# EasyEDA Pro project ProPrj_ftdi-jtag-xilinx_2025-01-01.epro, board PCB1
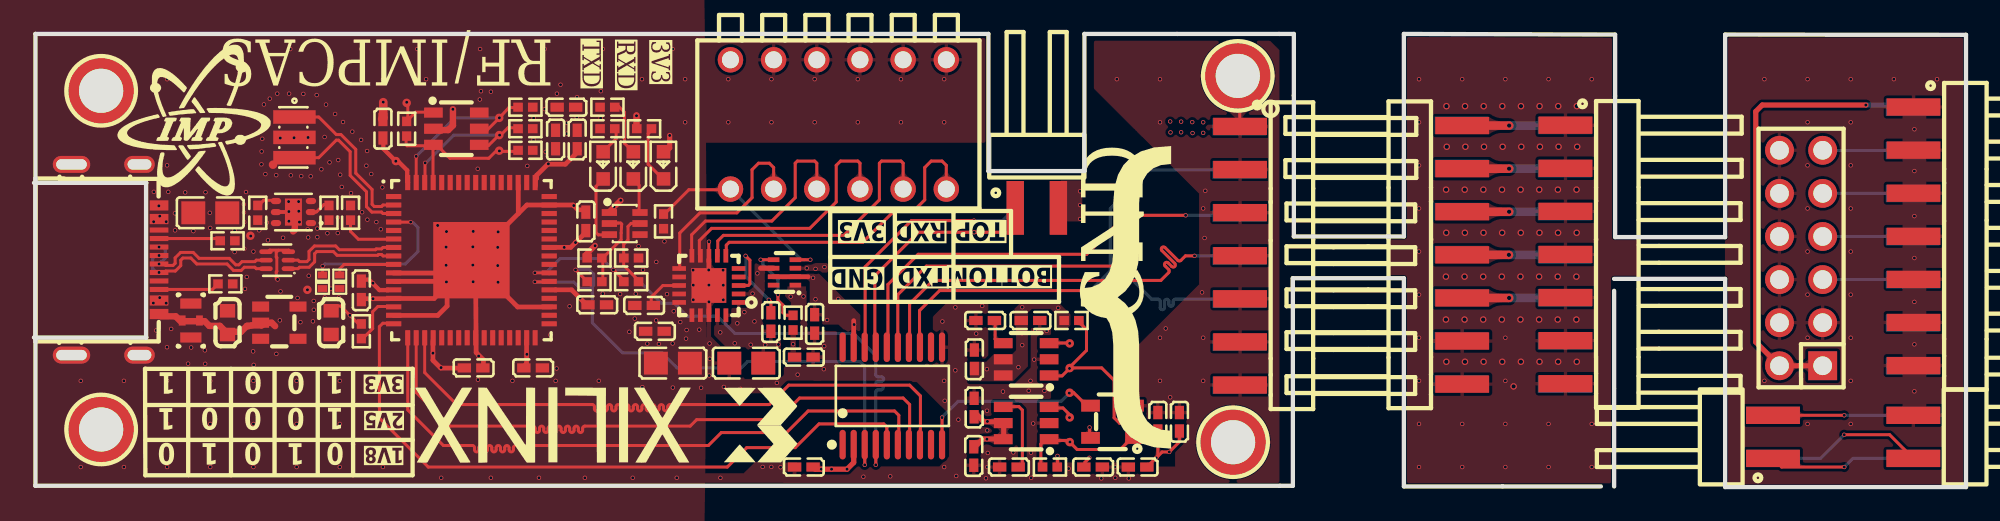
[diagram p3: board, top side]
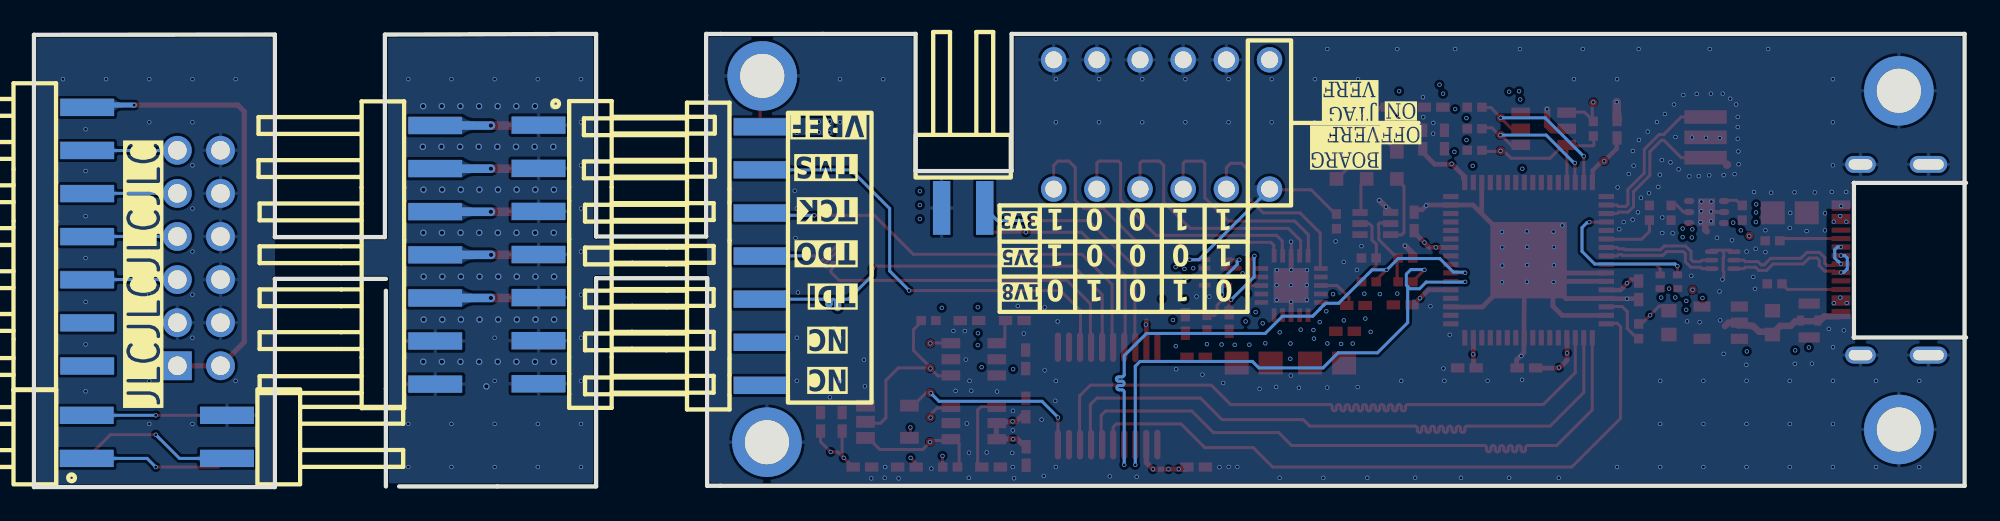
[diagram p4: board, bottom side, seen from below]

Outline 113.67 x 26.71 mm; copper layers: Top Layer, Inner1, Inner2, Bottom Layer. Coordinates in mm from the lower left corner of the outline.
Outline path: 74.07,12.31 80.6,12.31 80.6,0.04 92.19,0.04 ; 74.07,12.31 74.07,11.61 ; 74.07,12.31 74.07,0.08 0.08,0.08 0.08,26.71 56.15,26.71 56.15,18.62 61.8,18.62 61.8,26.71 74.12,26.71 74.12,14.77 80.6,14.77 80.6,19.34 80.6,19.34 80.6,26.71 93.03,26.67 93.03,14.73 99.5,14.73 99.5,19.3 99.5,19.3 99.5,26.67 113.67,26.66 113.67,0 99.5,0 99.5,12.27 92.97,12.27 ; 92.97,11.57 92.97,0.04
Stack: Top Layer 0.035mm 外层铜厚1oz / Dielectric1 0.2104mm 7628 RC49% 8.6mil / Inner1 0.0152mm 内层铜厚 / Dielectric2 1.065mm 1.1mm H/HOZ Copper / Inner2 0.0152mm 内层铜厚 / Dielectric3 0.2104mm 7628 RC49% 8.6mil / Bottom Layer 0.035mm 外层铜厚1oz

## Design rules (mm)
net USB_DP_O: USB2
net USB_DN_O: USB2
net USB_DN: USB1
net USB_DP: USB1
net OSCO: OSC
net OSCI: OSC
template: 自定义配置
spacing copperThickness1oz (default): track to track 0.102, other pairs 0.152 to 0.3
spacing copperThickness2oz: track to track 0.203, other pairs 0.152 to 0.3
track width copperThickness1oz (default): min 0.127, default 0.178, max 2.54
track width copperThickness2oz: min 0.203, default 0.254, max 2.54
differential pair differentialPair (default): width min 0.127, default 0.254, max 2.54; gap min 0.152, default 0.152
via viaSize (default): diameter min 0.254, default 0.254, max 10; hole min 0.178, default 0.178, max 6.3

## Placement (name value [footprint] x y rotation side)
C1  100nF  [C0402]  25.87 7.02 180 top
C2  100nF  [C0402]  29.37 7.02 180 top
C3  100nF  [C0402]  32.47 15.66 270 top
C4  100nF  [C0402]  30.69 20.48 270 top
C5  100nF  [C0402]  55.31 4.69 270 top
C6  100nF  [C0402]  55.29 1.83 90 top
C7  100nF  [C0402]  62.31 1.18 180 top
C8  100nF  [C0402]  67.39 3.85 270 top
C9  100nF  [C0402]  31.96 20.48 270 top
C10  100nF  [C0402]  33.14 10.74 180 top
C11  100nF  [C0402]  20.53 21.12 270 top
C12  10uF  [C0603]  11.39 9.69 270 top
C13  4.7uF  [C0402]  19.26 11.59 270 top
C14  100nF  [C0402]  31.33 22.39 180 top
C15  NFM21PC104R1E3D  [CAP-SMD_4P-L2.0-W1.25]  9.23 9.82 270 top
C16  10uF  [C0603]  17.48 9.69 90 top
C17  22uF  [C0805]  10.37 16.17 0 top
C18  100nF  [C0402]  66.12 3.85 270 top
C19  100nF  [C0402]  55.33 7.53 270 top
C20  100nF  [C0402]  45.3 1.18 0 top
C21  100pF  [C0402]  57.36 1.18 0 top
C22  100pF  [C0402]  55.96 9.82 0 top
C23  22uF  [C0805]  37.59 7.31 180 top
C24  100nF  [C0402]  36.53 9.18 180 top
C25  22uF  [C0805]  41.91 7.31 180 top
C26  100nF  [C0402]  64.93 1.18 0 top
C27  100nF  [C0402]  45.3 7.66 180 top
C28  100nF  [C0402]  58.63 9.82 180 top
C29  100nF  [C0402]  45.93 9.62 90 top
C30  10nF  [C0402]  35.9 10.71 180 top
C31  10nF  [C0402]  43.35 9.73 90 top
H1  PZ2.54-2x6-11.2  [HDR-TH_12P-P2.54-V-M-R2-C6-S2.54]  103.97 13.5 90 top
L1  ECMF02-2AMX6  [UFQFN-6_L1.7-W1.5]  14.31 13.37 180 top
L2  BLM15PD121SN1D  [L0402]  17.99 12.1 270 top
L3  BLM15PD121SN1D  [L0402]  16.98 12.1 90 top
LED1  NCD0603Y1  [LED0603-RD]  37.04 18.96 90 top
LED2  NCD0603Y1  [LED0603-RD]  35.26 18.96 90 top
LED3  NCD0603Y1  [LED0603-RD]  33.49 18.96 90 top
Q1  BSS138PS,115  [SOT-363_L2.0-W1.3-P0.65-LS2.1-BR]  34.76 15.53 180 top
R1  5.1kΩ  [R0402]  11.26 11.98 180 top
R2  5.1kΩ  [R0402]  11.39 14.52 180 top
R3  10kΩ  [R0402]  35.9 21.12 0 top
R4  10kΩ  [R0402]  33.74 22.39 180 top
R5  100kΩ  [R0402]  32.98 13.5 0 top
R6  56kΩ  [R0402]  17.36 16.17 270 top
R7  100Ω  [R0402]  32.98 12.1 180 top
R8  100kΩ  [R0402]  35.14 13.5 0 top
R9  100Ω  [R0402]  35.14 12.1 0 top
R10  10kΩ  [R0402]  28.91 22.39 180 top
R11  10kΩ  [R0402]  28.91 21.12 180 top
R12  200kΩ  [R0402]  13.17 16.17 270 top
R13  10kΩ  [R0402]  33.74 21.12 0 top
R14  12kΩ  [R0402]  18.63 16.17 270 top
R15  1kΩ  [R0402]  19.26 9.18 270 top
R16  10kΩ  [R0402]  59.77 1.18 180 top
R17  10kΩ  [R0402]  61.04 9.82 0 top
R18  2kΩ  [R0402]  21.93 21.12 270 top
R19  10kΩ  [R0402]  28.91 19.85 0 top
R20  10kΩ  [R0402]  44.66 9.69 90 top
R21  10kΩ  [R0402]  37.04 15.66 90 top
SW1  SMQP-06B-TP  [SW-TH_12P-P2.54_SMQP-06B-TP]  47.33 21.37 180 top
TP1  -  [Test-Point-0.5mm]  21.29 19.22 0 top
TP2  -  [Test-Point-0.5mm]  12.73 14.81 270 top
TP3  -  [Test-Point-0.5mm]  16.09 11.63 0 top
TP4  -  [Test-Point-0.5mm]  27.37 21.76 0 top
TP5  -  [Test-Point-0.5mm]  27.37 20.75 0 top
TP6  -  [Test-Point-0.5mm]  21.93 22.64 0 top
TP7  -  [Test-Point-0.5mm]  60.94 2.65 0 top
TP8  -  [Test-Point-0.5mm]  60.94 7.01 0 top
TP9  -  [Test-Point-0.5mm]  27.37 19.83 0 top
TP10  -  [Test-Point-0.5mm]  60.94 4.11 0 top
TP11  -  [Test-Point-0.5mm]  60.94 8.47 0 top
TP12  -  [Test-Point-0.5mm]  60.94 5.56 0 top
TP13  -  [Test-Point-0.5mm]  14.06 19 0 top
U1  -  [JTAG_V3]  71.08 13.63 0 top
U2  FT2232HQ-REEL  [QFN-64_L9.0-W9.0-P0.50-TL-EP4.3]  25.74 13.37 0 top
U3  -  [2x2p侧贴排针]  59 16.45 90 top
U4  TPS25200DRVR  [WSON-6_L2.0-W2.0-P0.65-TL-EP]  15.27 16.21 180 top
U5  TPS7A2033PDBVR  [SOT-23-5_L2.9-W1.6-P0.95-LS2.8-BR]  14.44 9.69 180 top
U6  93LC56BT-I/OT  [SOT-23-6_L2.9-W1.6-P0.95-LS2.8-BR]  24.85 21.12 180 top
U7  TPS3808G33DBVR  [SOT-23-6_L2.9-W1.6-P0.95-LS2.8-BR]  58.38 7.53 0 top
U8  SN74LVC1G08DBVR  [TSOT-23-5_L2.9-W1.6-P0.95-LS2.8-BR]  63.46 3.85 0 top
U9  TPS3808G33DBVR  [SOT-23-6_L2.9-W1.6-P0.95-LS2.8-BR]  58.38 3.77 0 top
U10  TXB0108PWR  [TSSOP-20_L6.5-W4.4-P0.65-LS6.4-BL]  50.5 5.37 0 top
U11  TPS7A8300RGRR  [VQFN-20_L3.5-W3.5-P0.50-BL-EP2.0]  39.71 11.88 90 top
U12  -  [M2焊接螺柱]  3.95 23.36 0 top
U13  -  [M2焊接螺柱]  70.55 2.64 90 top
U14  -  [M2焊接螺柱]  3.95 3.4 0 top
U15  -  [M2焊接螺柱]  70.83 24.23 90 top
U16  TPS2116DRLR  [SOT-583-8_L2.1-W1.6-P0.50-LS1.6-BL]  44.16 12.65 90 top
U17  -  [JTAG_V3]  110.7 14.77 0 top
U18  -  [JTAG_V3]  83.87 13.7 180 bottom
U19  -  [JTAG_V3]  90.22 13.7 0 top
U20  -  [2x2p侧贴排针]  110.57 2.96 0 bottom
U21  -  [2x2p侧贴排针]  102.32 2.96 180 top
USB1  TYPEC-302-BRP16SC16  [USB-C-SMD_TYPEC-302-BRP16SC16]  4.78 13.4 270 top
X1  12MHz  [CRYSTAL-SMD_3P-L3.2-W1.3-P1.2-BL]  15.32 20.61 270 top

## Footprints (pads in the part's own frame, mm; a bottom-side part is the same pattern mirrored in y, then rotated)
2x2p侧贴排针
  rect 3.17x1.02 smd: 1(0,1.27) 3(0,-1.27)
  rect 3.17x1.02 smd far side: 2(0,1.27) 4(0,-1.27)
C0402
  rect 0.79x0.54 smd: 1(-0.545,0) 2(0.545,0)
C0603
  rect 0.8x0.9 smd: 1(-0.7,0) 2(0.7,0)
C0805
  rect 1.41x1.35 smd: 1(-1,0) 2(1,0)
CAP-SMD_4P-L2.0-W1.25
  rect 0.6x1.25 smd: 1(-1,0) 3(1,0)
  rect 0.6x0.4 smd: 2(0,-0.508) 4(0,0.508)
CRYSTAL-SMD_3P-L3.2-W1.3-P1.2-BL
  rect 0.8x2.5 smd: 1(-1.2,0) 2(0,0) 3(1.2,0)
HDR-TH_12P-P2.54-V-M-R2-C6-S2.54
  rect 1.7x1.7 hole 1.1: 1(-6.35,-1.27)
  round 1.7 hole 1.1: 2(-6.35,1.27) 3(-3.81,-1.27) 4(-3.81,1.27) 5(-1.27,-1.27) 6(-1.27,1.27) 7(1.27,-1.27) 8(1.27,1.27) 9(3.81,-1.27) 10(3.81,1.27) 11(6.35,-1.27) 12(6.35,1.27)
JTAG_V3
  rect 3.17x1.02 smd: 1(-0.114,7.63) 3(-0.114,5.09) 5(-0.114,2.55) 7(-0.114,0.01) 9(-0.114,-2.53) 11(-0.114,-5.07) 13(-0.114,-7.61)
  rect 3.17x1.02 smd far side: 2(-0.158,7.606) 4(-0.158,5.066) 6(-0.158,2.526) 8(-0.158,-0.014) 10(-0.158,-2.554) 12(-0.158,-5.094) 14(-0.158,-7.634)
L0402
  rect 0.4x0.55 smd: 1(-0.4,0) 2(0.4,0)
LED0603-RD
  rect 0.8x0.8 smd: 1(-0.799,0) 2(0.799,0)
M2焊接螺柱
  round 4.1 hole 2.6: 1(0,0)
QFN-64_L9.0-W9.0-P0.50-TL-EP4.3
  rect 0.9x0.3 smd: 1(-4.575,3.75) 2(-4.575,3.25) 3(-4.575,2.75) 4(-4.575,2.25) 5(-4.575,1.75) 6(-4.575,1.25) 7(-4.575,0.75) 8(-4.575,0.25) 9(-4.575,-0.25) 10(-4.575,-0.75) 11(-4.575,-1.25) 12(-4.575,-1.75) 13(-4.575,-2.25) 14(-4.575,-2.75) 15(-4.575,-3.25) 16(-4.575,-3.75) 33(4.575,-3.75) 34(4.575,-3.25) 35(4.575,-2.75) 36(4.575,-2.25) 37(4.575,-1.75) 38(4.575,-1.25) 39(4.575,-0.75) 40(4.575,-0.25) 41(4.575,0.25) 42(4.575,0.75) 43(4.575,1.25) 44(4.575,1.75) 45(4.575,2.25) 46(4.575,2.75) 47(4.575,3.25) 48(4.575,3.75)
  rect 0.3x0.9 smd: 17(-3.75,-4.575) 18(-3.25,-4.575) 19(-2.75,-4.575) 20(-2.25,-4.575) 21(-1.75,-4.575) 22(-1.25,-4.575) 23(-0.75,-4.575) 24(-0.25,-4.575) 25(0.25,-4.575) 26(0.75,-4.575) 27(1.25,-4.575) 28(1.75,-4.575) 29(2.25,-4.575) 30(2.75,-4.575) 31(3.25,-4.575) 32(3.75,-4.575) 49(3.75,4.575) 50(3.25,4.575) 51(2.75,4.575) 52(2.25,4.575) 53(1.75,4.575) 54(1.25,4.575) 55(0.75,4.575) 56(0.25,4.575) 57(-0.25,4.575) 58(-0.75,4.575) 59(-1.25,4.575) 60(-1.75,4.575) 61(-2.25,4.575) 62(-2.75,4.575) 63(-3.25,4.575) 64(-3.75,4.575)
  rect 4.5x4.5 smd: 65(0,-0.001)
R0402
  rect 0.566x0.54 smd: 1(-0.433,0) 2(0.433,0)
SOT-23-5_L2.9-W1.6-P0.95-LS2.8-BR
  rect 1x0.6 smd: 1(1.1,-0.95) 2(1.1,0) 3(1.1,0.95) 4(-1.1,0.95) 5(-1.1,-0.95)
SOT-23-6_L2.9-W1.6-P0.95-LS2.8-BR
  rect 1.1x0.6 smd: 1(1.35,-0.95) 2(1.35,0) 3(1.35,0.95) 4(-1.35,0.95) 5(-1.35,0) 6(-1.35,-0.95)
SOT-363_L2.0-W1.3-P0.65-LS2.1-BR
  rect 0.9x0.4 smd: 1(0.9,-0.65) 2(0.9,0) 3(0.9,0.65) 4(-0.9,0.65) 5(-0.9,0) 6(-0.9,-0.65)
SOT-583-8_L2.1-W1.6-P0.50-LS1.6-BL
  rect 0.28x0.68 smd: 1(-0.75,-0.64) 2(-0.25,-0.64) 3(0.25,-0.64) 4(0.75,-0.64) 5(0.75,0.64) 6(0.25,0.64) 7(-0.25,0.64) 8(-0.75,0.64)
SW-TH_12P-P2.54_SMQP-06B-TP
  round 1.5 hole 1: 1(-6.35,-3.81) 2(-3.81,-3.81) 3(-1.27,-3.81) 4(1.27,-3.81) 5(3.81,-3.81) 6(6.35,-3.81) 7(6.35,3.81) 8(3.81,3.81) 9(1.27,3.81) 10(-1.27,3.81) 11(-3.81,3.81) 12(-6.35,3.81)
Test-Point-0.5mm
  round 0.5 smd: 1(0,0)
TSOT-23-5_L2.9-W1.6-P0.95-LS2.8-BR
  rect 1.1x0.7 smd: 1(1.294,-0.951) 2(1.294,-0.001) 3(1.294,0.951) 4(-1.294,0.951) 5(-1.294,-0.949)
TSSOP-20_L6.5-W4.4-P0.65-LS6.4-BL
  oval 0.364x1.742 smd: 1(-2.925,-2.871) 2(-2.275,-2.871) 3(-1.625,-2.871) 4(-0.975,-2.871) 5(-0.325,-2.871) 6(0.325,-2.871) 7(0.975,-2.871) 8(1.625,-2.871) 9(2.275,-2.871) 10(2.925,-2.871) 11(2.925,2.871) 12(2.275,2.871) 13(1.625,2.871) 14(0.975,2.871) 15(0.325,2.871) 16(-0.325,2.871) 17(-0.975,2.871) 18(-1.625,2.871) 19(-2.275,2.871) 20(-2.925,2.871)
UFQFN-6_L1.7-W1.5
  oval 0.79x0.28 smd: 1(-0.657,0.5) 2(-0.657,0) 3(-0.657,-0.5) 4(0.657,-0.5) 5(0.657,0) 6(0.657,0.5)
USB-C-SMD_TYPEC-302-BRP16SC16
  rect 0.6x1.1 smd: 1(-3.2,2.575) 2(-2.4,2.575) 11(2.4,2.575) 12(3.2,2.575)
  rect 0.3x1.1 smd: 3(-1.75,2.575) 4(-1.25,2.575) 5(-0.75,2.575) 6(-0.25,2.575) 7(0.25,2.575) 8(0.75,2.575) 9(1.25,2.575) 10(1.75,2.575)
  oval 1x1.8 hole 0.61x1.4: 13(-5.62,1.425) 14(5.62,1.425)
  oval 1x2.2 hole 0.61x1.8: 15(-5.62,-2.575) 16(5.62,-2.575)
VQFN-20_L3.5-W3.5-P0.50-BL-EP2.0
  rect 0.28x0.8 smd: 1(-1.001,-1.751) 2(-0.501,-1.751) 3(-0.001,-1.751) 4(0.499,-1.751) 5(1,-1.749) 11(0.999,1.749) 12(0.501,1.751) 13(-0.001,1.749) 14(-0.501,1.749) 15(-1.001,1.749)
  rect 0.8x0.28 smd: 6(1.75,-0.999) 7(1.75,-0.499) 8(1.75,0.001) 9(1.75,0.501) 10(1.75,1.001) 16(-1.75,0.999) 17(-1.75,0.499) 18(-1.75,-0.001) 19(-1.75,-0.501) 20(-1.75,-1.001)
  rect 2.05x2.05 smd: 21(-0.001,-0.001)
WSON-6_L2.0-W2.0-P0.65-TL-EP
  oval 0.607x0.364 smd: 1(-1.028,0.65) 2(-1.028,0) 3(-1.028,-0.65) 4(1.028,-0.65) 5(1.028,0) 6(1.028,0.65)
  rect 1x1.6 smd: 7(0,0)

## Nets
As in the schematic.

Pads without a net: U1 12 14; U2 21 22 23 24 26 27 28 29 30 32 33 34 36 40 41 43 44 45 46 48 52 53 54 55 57 58 59 60; U4 3; U5 4; U10 1 9 12 20; U11 4 5 12; U16 8; U17 12 14; USB1 3 9

## Via types
v1: diameter 0.254, hole 0.178, Top Layer to Bottom Layer, 451 vias
v2: diameter 0.381, hole 0.254, Top Layer to Bottom Layer, 62 vias

## Routing (per net, layer and track width the routed paths; a pad name or vN(x,y) marks a point on that pad's centre or on a via; arc(x,y) is an arc through that point)
3V3: length 24.8
  Top Layer w0.178: 62.09,3.01 62.11,3.02 v1(62.11,3.52) ; v1(62.09,1.72) 61.83,1.46 61.83,1.11 ; C18.2 66.12,1.83 C26.2 ; 19.14,9.56 18.04,10.67 17.74,10.67 ; v1(66.03,1.72) 66.38,2.07 v1(66.8,2.07) 67.39,2.67 C8.2 ; v1(60.22,1.84) 60.22,1.26 60.14,1.18
  Top Layer w0.28: 28.71,6.99 28.98,7.27 28.98,8.65 ; 30.58,14.13 31.58,14.13 32.44,14.99 ; 23.47,8.63 v1(23.47,7.89) 23.47,7.47 23.93,7.01 25.2,7.01
  Top Layer w0.305: 57.05,2.86 57.05,3.55 56.7,3.9 ; v1(37.4,20.73) 37.4,19.99 37.04,19.62 ; 55.3,2.31 55.82,2.83 56.71,2.83 ; 56.7,3.85 55.89,3.85 55.46,4.28 ; U10.2 48.23,1.45 v1(47.84,1.05) v1(46.93,1.05) v1(46.32,1.05) 45.97,1.05 C20.2
  vias: v1(15.51,11.15) v1(16.09,11.63) v1(16.46,10.97) v1(16.47,10.45) v1(17.11,11.17) v1(17.47,11.7) v1(17.94,11.17) v1(18.59,10.13) v1(23.95,7.04) v1(26.11,18.76) v1(26.23,22.84) v1(26.3,23.33) v1(26.88,23.3) v1(29.02,18.93) v1(29,7.82) v1(29.4,21.75) v1(29.39,20.45) v1(30.05,22.28) v1(30.1,19.76) v1(30.77,23.19) v1(30.98,23.72) v1(31.2,14.12) v1(31.86,14.41) v1(33.35,23.33) v1(33.34,21.75) v1(44.66,8.42) v1(56.1,3.87) v1(56.07,2.82) v1(61.55,17.44) v1(61.55,16.62) v1(61.55,15.8)
3V3_CONN: length 8.3
  Top Layer w0.178: v1(106.51,4.23) U21.3
  Bottom Layer w0.178: U20.3 v1(106.51,4.23)
+5V:
  vias: v1(9.25,8.23) v1(10.05,8.06) v1(12.89,8) v1(16.1,15.19) v1(16.13,14.71) v1(16.67,15.24) v1(16.67,14.73) v1(36.09,8.46) v1(36.61,9.82) v1(36.77,8.44) v1(37.24,11.37) v1(37.58,8.46) v1(37.64,10.36) v1(38.03,9.73) v1(38.4,9.26) v1(38.36,8.75) v1(39.14,9.28)
GND: length 53.1
  Top Layer w0.178: 14.37,13.96 14.25,13.84 14.25,13.56 14.29,13.53 14.29,12.72 14.25,12.68 14.25,12.27 ; 70.94,21.29 70.94,23.2 ; 15.03,13.92 14.99,13.96 13.87,13.96 13.72,13.82 ; v1(39.71,14.46) 39.7,14.45 39.71,13.41
  Top Layer w0.229: 14.86,16.2 14.85,16.21 14.38,16.21
  Top Layer w0.28: 19.3,11.1 v1(19.95,11.1) 20.91,11.1 ; 39.71,12.06 39.71,13.41 ; 32.37,16.34 32.01,16.34 31.73,16.63 29,16.63 28.5,16.12 28.5,17.81 ; 28.44,16.06 27.7,15.32 ; 23.74,11.31 23.54,11.11 21.08,11.11 ; 26.01,11.36 25.99,11.34 26.02,7.93 26.45,7.5 26.45,7 ; 21.16,10.11 23.75,10.11 24.31,10.67 24.31,11.37 24.32,11.38 ; 27.54,11.53 28.46,10.62 30.45,10.62 ; 21.16,12.13 23.89,12.13 24.01,12.24 ; 21.16,12.61 23.71,12.61 ; 39.77,12.06 39.71,12 39.71,10.21
  Top Layer w0.33: 34.52,16.89 34.51,16.89 33.8,16.19 ; 33.01,14.24 32.46,13.69 32.46,13.5
  Top Layer w0.381: 8.73,9.77 9.64,9.77 ; 9.64,9.77 10.04,9.77 10.31,9.5 10.94,9.5 11.52,8.91 ; 9.64,9.77 9.67,9.81 ; 13.51,9.65 13.4,9.53 12.83,9.53 arc(12.73,9.52) 12.63,9.49 12.6,9.49 ; 23.47,21.04 24.37,21.04 24.65,21.32 v1(24.65,22.27) ; 8.62,9.78 8.33,10.06 7.47,10.06 ; 11.34,9.15 12.18,9.15 12.53,9.5 12.59,9.5 ; 14.18,9.49 13.98,9.69 13.48,9.69 ; 15.35,15.96 15.35,15.17 15.25,15.07 ; 35.45,21.08 35.45,21.91
  Top Layer w0.508: 20.49,21.69 20.55,21.75 20.55,22.68
  vias: v1(2.75,6.26) v1(2.75,1.18) v1(5.29,6.26) v1(5.29,1.18) v1(7.05,17.4) v1(7.19,9.23) v1(7.35,16.57) v1(7.83,24.04) v1(7.83,21.5) v1(7.83,18.96) v1(7.83,8.24) v1(7.83,6.26) v1(7.83,3.72) v1(7.83,1.18) v1(7.9,17.4) v1(8.07,9.32) v1(8.3,16.14) v1(8.3,15.13) v1(8.9,17.37) v1(9.07,7.28) v1(9.38,15.09) v1(10.09,17.37) v1(10.07,7.26) v1(10.34,16.16) v1(10.37,15.27) v1(10.37,6.26) v1(10.37,3.72) v1(10.37,1.18) v1(11.47,17.35) v1(11.64,25.82) v1(11.8,15.13) v1(11.8,13.85) v1(12.37,14.05) v1(12.42,11.68) v1(12.47,17.39) v1(12.52,12.39) v1(12.91,13.88) v1(12.92,7.2) v1(12.91,6.26) v1(12.91,3.72) v1(12.91,1.18) v1(13.43,21.82) v1(13.43,21.22) v1(13.43,20.53) v1(13.39,19.78) v1(13.38,19.02) v1(13.53,22.55) v1(13.62,18.45) v1(13.77,14.55) v1(13.87,22.89) v1(14.31,23.19) v1(14.25,18.39) v1(14.33,12.23) v1(14.26,7.85) v1(14.49,20.57) v1(14.51,11.53) v1(14.46,9.83) v1(14.65,14.69) v1(15.01,23.19) v1(14.98,16.83) v1(15,16.24) v1(15,15.67) v1(15.08,25.82) v1(15.11,18.37) v1(15.3,20.59) v1(15.45,6.26) v1(15.45,3.72) v1(15.45,1.18) v1(15.57,16.83) v1(15.58,16.26) v1(15.62,15.62) v1(15.72,18.33) v1(15.68,9.72) v1(15.85,23.17) v1(16.12,20.6) v1(16.16,12.46) v1(16.28,18.32) v1(16.41,9.77) v1(16.63,23.11) v1(16.91,18.73) v1(17.1,20.63) v1(17.18,22.55) v1(17.26,14.96) v1(17.39,19.14) v1(17.72,21.99) v1(17.9,19.27) v1(17.87,15.89) v1(17.87,14.97) v1(18.02,18.41) v1(17.99,6.26) v1(17.99,3.72) v1(17.99,1.18) v1(18.11,17.69) v1(18.18,21.52) v1(18.73,20.95) v1(18.65,17.33) v1(19.13,17.05) v1(19.26,25.82) v1(19.25,20.46) v1(19.31,16.2) v1(19.6,19.81) v1(19.56,18.94) v1(19.62,15.76) v1(19.84,18.45) v1(20.14,15.62) v1(20.41,15.2) v1(20.53,24.04) v1(20.5,17.66) v1(20.53,1.18) v1(20.55,22.69) v1(22.55,25.82) v1(23.07,24.04) v1(23.75,15.42) v1(23.96,0.55) v1(24.27,15.06) v1(24.25,14.15) v1(24.25,13.07) v1(24.27,12.09) v1(25.82,14.16) v1(25.82,13.09) v1(25.84,15.07) v1(25.84,12.1) v1(26.12,6.33) v1(26.16,7.72) v1(26.25,25.82) v1(26.88,0.55) v1(27.31,15.04) v1(27.28,14.13) v1(27.28,13.06) v1(27.3,12.07) v1(28.15,6.26) v1(29.71,0.55) v1(30.06,25.82) v1(30.38,8.97) v1(30.69,6.26) v1(30.75,6.99) v1(31.34,21.47) v1(31.35,20.83) v1(31.51,10.66) v1(31.76,16.59) v1(31.95,22.98) v1(31.94,21.8) v1(32.41,0.55) v1(33.01,14.22) v1(33.23,6.26) v1(33.47,25.82) v1(33.46,11.4) v1(34.13,16.52) v1(34.52,16.9) v1(34.49,11.38) v1(35.03,9.15) v1(35.23,0.55) v1(35.4,11.4) v1(35.34,9.93) v1(35.45,21.89) v1(35.57,14.2) v1(35.77,24.04) v1(35.83,12.8) v1(35.8,5.89) v1(36.61,13.27) v1(37.09,14.48) v1(37.58,25.82) v1(37.59,5.86) v1(37.82,0.55) v1(38.31,24.04) v1(38.31,21.5) v1(38.78,12.79) v1(38.79,11.9) v1(38.79,11.04) v1(39.25,5.85) v1(39.7,12.79) v1(39.71,11.91) v1(39.71,10.92) v1(39.73,6.57) v1(39.75,8.46) v1(39.76,7.56) v1(40.39,0.55) v1(40.54,12.79) v1(40.56,11.9) v1(40.56,11.04) v1(40.59,5.9) v1(40.85,24.04) v1(40.85,21.5) v1(41.56,5.79) v1(42.87,1.19) v1(43.39,24.04) v1(43.39,21.5) v1(43.38,1.19) v1(43.71,6.14) v1(43.93,1.17) v1(44.52,11.22) v1(44.93,6.62) v1(45.27,11.23) v1(45.93,24.04) v1(45.93,21.5) v1(46.49,8.3) v1(46.47,6.95) v1(48.47,24.04) v1(48.47,21.5) v1(48.8,0.61) v1(50.38,0.63) v1(51.01,24.04) v1(51.01,21.5) v1(53.45,9.76) v1(53.55,24.04) v1(53.55,21.5) v1(53.55,6.26) v1(53.58,5.09) v1(53.55,1.18) v1(54.21,10.59) v1(54.21,6.88) v1(54.26,0.65) v1(54.39,3.97) v1(55.44,9.05) v1(55.79,10.68) v1(56.01,0.52) v1(56.07,4.5) v1(56.08,3.34) v1(56.12,2.01) v1(56.09,1.18) v1(57.01,5.63) v1(57.62,2.04) v1(58.52,5.68) v1(58.63,6.26) v1(58.66,2.03) v1(58.67,0.54) v1(58.79,3.75) v1(58.9,9.19) v1(58.85,7.52) v1(59.45,5.67) v1(59.58,9.2) v1(60.88,1.09) v1(62.8,0.51) v1(63.59,1.18) v1(63.62,0.55) v1(63.71,24.04) v1(64.41,0.51) v1(64.78,5.94) v1(64.84,7.5) v1(66.25,24.04) v1(66.25,21.5) v1(66.25,8.8) v1(66.25,6.26) v1(66.59,9.35) v1(66.85,5.29) v1(68.72,11.47) v1(68.79,16.42) v1(68.79,8.8) v1(68.79,6.26) v1(68.91,17.46) v1(68.87,14.68) v1(81.49,24.04) v1(81.49,21.5) v1(81.49,18.96) v1(81.49,16.42) v1(81.49,13.88) v1(81.49,11.34) v1(81.49,8.8) v1(81.49,6.26) v1(81.49,3.72) v1(81.49,1.18) v1(84.03,24.04) v1(84.03,3.72) v1(84.03,1.18) v1(86.57,24.04) v1(86.57,8.8) v1(86.57,6.26) v1(86.57,3.72) v1(86.57,1.18) v1(89.11,24.04) v1(89.11,3.72) v1(89.11,1.18) v1(91.65,24.04) v1(91.65,3.72) v1(91.65,1.18) v1(101.81,24.04) v1(101.81,6.26) v1(104.35,24.04) v1(104.35,21.5) v1(104.35,18.96) v1(104.35,16.42) v1(104.35,13.88) v1(104.35,11.34) v1(104.35,8.8) v1(104.35,3.72) v1(106.89,24.04) v1(106.89,21.5) v1(106.89,18.96) v1(106.89,16.42) v1(106.89,13.88) v1(106.89,11.34) v1(106.89,8.8) v1(106.89,6.26) v1(106.89,3.72) v1(109.43,24.04) v1(110.64,21.09) v1(110.64,18.63) v1(110.64,15.97) v1(110.64,13.5) v1(110.64,10.92) v1(110.64,8.41) v1(110.64,5.64) v1(111.97,24.04) v2(83.1,22.45) v2(83.12,20.06) v2(83.08,17.53) v2(83.09,14.99) v2(83.07,12.4) v2(83.07,9.87) v2(83.1,7.39) v2(84.2,22.45) v2(84.22,20.06) v2(84.18,17.53) v2(84.19,14.99) v2(84.17,12.4) v2(84.17,9.87) v2(84.19,7.39) v2(85.3,22.45) v2(85.31,20.06) v2(85.28,17.53) v2(85.29,14.99) v2(85.27,12.4) v2(85.27,9.87) v2(85.29,7.39) v2(86.39,22.45) v2(86.41,20.06) v2(86.37,17.53) v2(86.38,14.99) v2(86.36,12.4) v2(86.36,9.87) v2(86.39,7.39) v2(87.06,5.93) v2(87.49,22.45) v2(87.51,20.06) v2(87.47,17.53) v2(87.48,14.99) v2(87.46,12.4) v2(87.46,9.87) v2(87.48,7.39) v2(88.58,22.45) v2(88.6,20.06) v2(88.56,17.53) v2(88.58,14.99) v2(88.56,12.4) v2(88.56,9.87) v2(88.58,7.39) v2(89.68,22.45) v2(89.7,20.06) v2(89.66,17.53) v2(89.67,14.99) v2(89.65,12.4) v2(89.65,9.87) v2(89.68,7.39) v2(90.78,22.45) v2(90.8,20.06) v2(90.76,17.53) v2(90.77,14.99) v2(90.75,12.4) v2(90.75,9.87) v2(90.77,7.39)
VCCB: length 3.6
  Top Layer w0.28: 48.23,9.81 U10.19 ; 43.47,12.4 45.55,12.4
  vias: v1(45.84,12.33) v1(45.98,11.07) v1(46.66,9.85) v1(47.32,11.09) v1(48.25,9.58) v1(56.06,6.95) v1(57.92,7.07) v1(58.14,10.6) v1(58.13,9.07) v1(58.14,8.36) v1(60.26,10.56)
100MV: length 18.2
  Top Layer w0.178: 40.73,13.67 40.73,14.26 40.9,14.43 48.76,14.43 50.76,16.42 51.9,16.42 52.41,16.93 52.41,18.83 52.79,19.22 53.42,19.22 53.68,18.96 SW1.12
200MV: length 16.6
  Top Layer w0.178: 51.15,17.47 51.2,17.47 ; 40.23,13.62 40.23,14.5 40.56,14.84 47.65,14.84 49.74,16.93 49.74,19.09 49.87,19.22 51.01,19.22 51.14,19.09 SW1.11
400MV: length 15
  Top Layer w0.178: 39.15,13.72 39.15,14.53 39.87,15.25 45.65,15.25 47.2,16.8 47.2,18.96 47.46,19.22 48.47,19.22 48.6,19.09 SW1.10
800MV: length 13.3
  Top Layer w0.178: SW1.9 46.06,19.09 45.93,19.21 44.91,19.21 44.79,19.09 44.79,17.06 43.41,15.68 39.5,15.68 38.69,14.87 38.69,13.47
1600MV: length 11.8
  Top Layer w0.178: SW1.8 43.52,18.83 43.26,19.09 42.63,19.09 42.25,18.71 42.25,17.06 41.35,16.16 39.18,16.16 37.99,14.97 ; 38,12.86 38,12.9 ; 38,12.9 38.09,12.9 ; 38,12.9 38,14.97
EE_CLK: length 8.6
  Top Layer w0.178: 27.29,20.68 26.75,20.14 26.24,20.14 ; 23.01,17.92 23.01,19.12 ; 27.45,20.74 27.89,21.18 28.37,21.18
  Bottom Layer w0.178: v1(27.39,20.75) 24.7,20.75 23.07,19.11
  vias: v1(23.02,19.11)
EE_CS: length 10.3
  Top Layer w0.178: 27.36,21.74 27.54,21.92 ; 27.36,21.74 27.94,22.37 28.28,22.37 ; 27.36,21.74 26.66,21.05 26.04,21.05 ; 22.49,18.08 22.49,19.5
  Bottom Layer w0.178: v1(27.38,21.76) 24.76,21.76 22.49,19.49
  vias: v1(22.49,19.49)
EE_DI: length 9.6
  Top Layer w0.178: 27.42,19.79 28.33,19.79 28.4,19.85 ; 21.89,20.6 21.89,20.18 21.95,20.12 23.53,20.12 ; 27.37,19.85 27.23,19.85 26.76,19.38 24.47,19.38 23.73,20.12 23.62,20.12 ; 23.45,17.93 23.45,18.05 23.48,18.07 23.48,20.03 23.58,20.14
  vias: v1(27.39,19.81)
EE_DO: length 2.7
  Top Layer w0.178: 22.02,21.66 22.45,22.1 23.53,22.1 ; 21.98,22.58 21.99,22.56 21.99,21.58
  vias: v1(21.93,22.68)
INT_VERF: length 0.8
  Top Layer w0.305: U16.6 42.76,12.9
  vias: v1(40.38,9.12) v1(41.23,8.47) v1(41.38,9.65) v1(41.8,10.31) v1(42.17,8.39) v1(42.28,11.4) v1(42.39,9.76) v1(42.56,12.59) v1(43.03,8.38) v1(43.8,8.4)
JTAG_TCK: length 39.6
  Top Layer w0.178: 21.27,9.66 20.53,9.66 20.32,9.45 20.33,4.05 23.2,1.18 40.79,1.18 41.94,2.32 44.79,2.32 46.19,3.72 50,3.72 50.18,3.54 U10.5
JTAG_TCK_O: length 26.1
  Top Layer w0.178: 50.24,8.23 50.24,11.94 52.02,13.72 61.94,13.72 64.23,16.02 v1(67.76,16.02)
  Bottom Layer w0.178: U1.6 70.78,16.02 v1(67.76,16.02)
JTAG_TDI: length 39.3
  Top Layer w0.178: U10.6 50.88,2.56 50.88,4.23 50.63,4.48 45.55,4.48 44.28,3.21 40.44,3.21 39.68,2.45 28.33,2.45 arc(28.24,2.41) 28.21,2.32 28.21,2.2 arc(28.08,2.07) 27.95,2.2 27.95,2.32 arc(27.83,2.45) 27.7,2.32 27.7,2.2 arc(27.57,2.07) 27.44,2.2 27.44,2.32 arc(27.32,2.45) 27.19,2.32 27.19,2.2 arc(27.06,2.07) 26.94,2.2 26.94,2.32 arc(26.81,2.45) 26.68,2.32 26.68,2.2 arc(26.56,2.07) 26.43,2.2 26.43,2.32 arc(26.3,2.45) 26.17,2.32 26.17,2.2 arc(26.05,2.07) 25.92,2.2 25.92,2.32 arc(25.88,2.41) 25.79,2.45 24.09,2.45 21.99,4.55 21.99,8.71
JTAG_TDI_O: length 26.5
  Top Layer w0.178: 50.82,8.35 50.82,11.34 52.51,13.02 64.19,13.02 v1(64.35,12.87)
  Bottom Layer w0.178: U1.10 67.15,11.07 arc(67.06,11.04) 67.03,10.95 67.03,10.78 arc(66.9,10.65) 66.77,10.78 66.77,10.95 arc(66.65,11.07) 66.52,10.95 66.52,10.58 arc(66.39,10.45) 66.27,10.58 66.27,10.95 arc(66.23,11.04) 66.14,11.07 65.76,11.07 64.35,12.48 v1(64.35,12.87)
JTAG_TDO: length 39.6
  Top Layer w0.178: U10.7 51.52,2.54 51.52,4.86 51.14,5.25 45.04,5.25 43.77,3.98 38.99,3.98 38.61,3.59 32.41,3.59 arc(32.32,3.56) 32.28,3.47 32.28,3.34 arc(32.15,3.21) 32.03,3.34 32.03,3.47 arc(31.9,3.59) 31.77,3.47 31.77,3.34 arc(31.65,3.21) 31.52,3.34 31.52,3.47 arc(31.39,3.59) 31.27,3.47 31.27,3.34 arc(31.14,3.21) 31.01,3.34 31.01,3.47 arc(30.88,3.59) 30.76,3.47 30.76,3.34 arc(30.63,3.21) 30.5,3.34 30.5,3.47 arc(30.38,3.59) 30.25,3.47 30.25,3.34 arc(30.12,3.21) 30,3.34 30,3.47 arc(29.87,3.59) 29.74,3.47 29.74,3.34 arc(29.61,3.21) 29.49,3.34 29.49,3.47 arc(29.45,3.56) 29.36,3.59 24.47,3.59 22.49,5.57 U2.18
JTAG_TDO_O: length 26.4
  Top Layer w0.178: 51.52,8.24 51.52,10.8 52.9,12.18 66.3,12.18 66.76,12.64 arc(66.8,12.73) 66.76,12.82 66.55,13.03 arc(66.55,13.21) 66.73,13.21 66.94,13 arc(67.12,13) 67.12,13.18 66.36,13.94 arc(66.36,14.12) 66.54,14.12 67.3,13.36 arc(67.39,13.32) 67.48,13.36 67.75,13.63 v1(68.28,13.63)
  Bottom Layer w0.178: v1(68.28,13.63) 70.91,13.63
JTAG_TMS: length 39.6
  Top Layer w0.178: 52.15,3.34 52.15,5.37 51.52,6.01 44.41,6.01 43.26,4.86 37.42,4.86 arc(37.33,4.83) 37.29,4.74 37.29,4.62 arc(37.16,4.49) 37.04,4.62 37.04,4.74 arc(36.91,4.86) 36.78,4.74 36.78,4.61 arc(36.66,4.48) 36.53,4.61 36.53,4.74 arc(36.4,4.86) 36.28,4.74 36.28,4.61 arc(36.15,4.48) 36.02,4.61 36.02,4.74 arc(35.89,4.86) 35.77,4.74 35.77,4.61 arc(35.64,4.48) 35.51,4.61 35.51,4.74 arc(35.39,4.86) 35.26,4.74 35.26,4.61 arc(35.13,4.48) 35.01,4.61 35.01,4.74 arc(34.88,4.86) 34.75,4.74 34.75,4.61 arc(34.62,4.48) 34.5,4.61 34.5,4.74 arc(34.37,4.86) 34.24,4.74 34.24,4.61 arc(34.12,4.48) 33.99,4.61 33.99,4.74 arc(33.86,4.86) 33.73,4.74 33.73,4.61 arc(33.61,4.48) 33.48,4.61 33.48,4.74 arc(33.35,4.86) 33.23,4.74 33.23,4.61 arc(33.1,4.48) 32.97,4.61 32.97,4.74 arc(32.94,4.83) 32.85,4.86 24.87,4.86 22.99,6.75 U2.19
JTAG_TMS_O: length 26.5
  Top Layer w0.178: v1(62.19,11.58) 53.28,11.58 52.1,10.4 52.1,8.35
  Bottom Layer w0.178: U1.4 65.6,18.69 63.33,16.42 63.33,12.74 62.19,11.59
JTAG_VREF:
  vias: v1(45.47,12.9) v1(45.98,12.86) v1(46.51,12.97) v1(66.85,21.55) v1(66.87,20.9) v1(67.49,21.54) v1(67.49,20.91) v1(68.15,21.51) v1(68.17,20.87) v1(68.79,21.5) v1(68.79,20.88)
MR#/A: length 1.4
  Top Layer w0.178: 59.76,4.66 60.54,4.66 60.98,4.22
  vias: v1(60.92,4.09)
MR#/B: length 1.2
  Top Layer w0.178: 60.9,8.49 59.77,8.49 59.75,8.47
  vias: v1(60.94,8.47)
OSCI: length 9.4
  Top Layer w0.178: U2.2 20.53,16.62 20.45,16.54 20.02,16.54 19.89,16.66 19.89,17.54 18.93,18.5 18.93,19.9 18.06,20.78 17.79,20.78 16.75,21.81 X1.1
OSCO: length 9.4
  Top Layer w0.178: U2.3 20.53,16.12 20.45,16.21 19.88,16.21 19.56,16.53 19.56,17.4 18.6,18.37 18.6,19.77 17.92,20.45 17.79,20.45 16.75,19.41 X1.3
RESET#/OE/A: length 6.5
  Top Layer w0.178: 60.87,2.75 60.01,2.75 59.9,2.86 ; 59.24,1.12 59.24,2.54 59.52,2.82 ; 64.33,2.64 63.91,2.22 61.38,2.22 60.97,2.63
  vias: v1(60.95,2.66)
RESET#/OE/B: length 10.7
  Top Layer w0.178: 60.89,6.96 60.49,6.56 59.73,6.56 ; 61,7.02 62.82,7.02 63.55,6.29 63.55,4.08 63.87,3.76 64.58,3.76 ; 61,7.13 61.93,8.06 61.93,9.28 61.52,9.68
  vias: v1(60.93,6.99)
RESET#/OE/Y: length 10.9
  Top Layer w0.178: 60.98,5.57 61.17,5.57 61.92,4.82 ; U10.10 v1(53.43,4.1)
  Bottom Layer w0.178: v1(60.91,5.54) 60.43,5.05 54.37,5.05 53.41,4.09
TCK_CONN: length 11.3
  Top Layer w0.508: U18.10 v2(86.79,11.15)
  Bottom Layer w0.178: U17.10 110.53,12.23 H1.5
  Bottom Layer w0.508: v2(86.79,11.15) U19.10
TDI_CONN: length 11.3
  Top Layer w0.508: U18.6 v2(86.79,16.23)
  Bottom Layer w0.178: U17.6 110.53,17.31 H1.9
  Bottom Layer w0.508: v2(86.79,16.23) U19.6
TDO_CONN: length 11.3
  Top Layer w0.508: U18.8 v2(86.78,13.69)
  Bottom Layer w0.178: U17.8 110.53,14.77 H1.7
  Bottom Layer w0.508: v2(86.78,13.69) U19.8
TMS_CONN: length 11.3
  Top Layer w0.508: U18.4 v2(86.79,18.77)
  Bottom Layer w0.178: H1.11 105.25,19.84 U17.4
  Bottom Layer w0.508: v2(86.79,18.77) U19.4
UART_RXD: length 33.6
  Top Layer w0.178: U10.4 v1(49.53,1.31) ; 30.32,12.58 30.27,12.63 v1(29.47,12.63) ; 34.75,12.14 34.09,12.8
  Bottom Layer w0.178: 34.11,12.77 33.41,13.47 30.96,13.47 30.16,12.67 29.47,12.67 ; v1(34.09,12.8) 34.94,12.8 36.91,10.83 37.68,10.83 37.78,10.73 37.79,10.73 38.01,10.52 38.01,10.5 38.44,10.07 40.22,10.07 41.23,9.06 48.22,9.06 49.53,7.74 49.53,6.62 arc(49.57,6.53) 49.66,6.49 49.87,6.49 arc(50,6.37) 49.87,6.24 49.66,6.24 arc(49.53,6.11) 49.66,5.99 49.84,5.99 arc(49.96,5.86) 49.84,5.73 49.66,5.73 arc(49.57,5.69) 49.53,5.61 v1(49.53,1.31)
UART_RXD_CONN: length 8.7
  Top Layer w0.178: v1(106.51,1.18) 102.83,1.18 U21.1
  Bottom Layer w0.178: U20.1 107.02,1.69 v1(106.51,1.18)
UART_RXD_O: length 13.4
  Top Layer w0.178: 57.56,15.04 57.53,15.02 v1(55.32,15.02) 52.04,15.02 49.47,12.45 49.47,8.21
UART_TXD: length 33.6
  Top Layer w0.178: v1(31.86,12.8) 32.5,12.17 32.5,12.09 ; v1(29.47,12.09) 30.03,12.09 30.08,12.14 ; U10.3 v1(48.88,1.31)
  Bottom Layer w0.178: 29.52,12.08 31.76,12.08 32.15,11.69 32.72,11.69 32.85,11.82 ; 32.85,11.82 32.93,11.9 32.93,12.56 32.67,12.82 31.87,12.82 ; 32.85,11.82 32.85,9.69 34.63,7.91 36.95,7.91 37.84,7.02 41.6,7.02 41.99,7.4 48.6,7.4 48.88,7.12 v1(48.88,1.31)
UART_TXD_CONN: length 9.4
  Top Layer w0.178: v1(106.51,3.09) 109.18,3.09 U20.2
  Bottom Layer w0.178: U21.2 105.11,1.69 v1(106.51,3.09)
UART_TXD_O: length 15
  Top Layer w0.178: 48.9,8.24 48.9,12.98 51.63,15.71 v1(55.3,15.71)
  Bottom Layer w0.178: U3.2 56.99,15.71 55.29,15.71
USB_5V:
  vias: v1(7.02,10.85) v1(7.04,15.64) v1(7.4,15.97) v1(7.4,11.17) v1(7.78,15.64) v1(7.78,10.84) v1(12.35,16.67) v1(12.35,16.19) v1(12.37,15.62) v1(12.75,14.8) v1(13.25,15.13) v1(13.7,15.59)
USB_CC1: length 3.7
  Top Layer w0.178: R2.2 10.82,14.65 7.36,14.65
USB_CC2: length 3.6
  Top Layer w0.178: R1.2 10.5,11.65 7.36,11.65
USB_DN: length 8.7
  Top Layer w0.178: v1(7.36,13.15) 7.66,13.15 7.75,13.06 8.18,13.06 8.3,13.19 8.3,13.51 8.62,13.83 9.37,13.83 9.72,13.48 11.49,13.48 11.87,13.1 12.05,13.1 12.24,13.29 12.99,13.29 13.08,13.37 L1.5
  Bottom Layer w0.178: v1(7.36,14.15) 7.56,14.15 7.73,13.99 7.73,13.5 7.51,13.28 7.49,13.28 v1(7.36,13.15)
USB_DN_O: length 7
  Top Layer w0.178: L1.2 15.54,13.37 15.62,13.29 16.06,13.29 16.18,13.41 16.18,13.89 16.5,14.21 17.75,14.21 17.97,13.99 20.09,13.99 20.14,14.04 20.45,14.04 20.53,14.12 U2.7
USB_DP: length 8.8
  Top Layer w0.178: L1.6 13.08,12.87 12.99,12.96 12.38,12.96 12.19,12.77 11.74,12.77 11.36,13.15 9.58,13.15 9.23,13.5 8.76,13.5 8.63,13.37 8.63,13.05 8.32,12.73 7.75,12.73 7.66,12.65 v1(7.36,12.65)
  Bottom Layer w0.178: v1(7.36,12.65) 7.2,12.65 6.98,12.87 6.98,13.5 7.13,13.65 v1(7.36,13.65)
USB_DP_O: length 7
  Top Layer w0.178: U2.8 20.53,13.62 20.45,13.71 20.27,13.71 20.22,13.66 17.83,13.66 17.61,13.88 16.64,13.88 16.51,13.75 16.51,13.28 16.19,12.96 15.62,12.96 15.54,12.87 L1.1
VCORE: length 11.2
  Top Layer w0.254: 19.29,12.19 19.33,12.23 19.71,12.23 20.33,11.61 20.83,11.61 20.84,11.62 ; 20.56,20.52 20.56,19.94 21.35,19.15 21.48,19.15 21.96,18.67 21.96,18.01 22.01,17.96
  Top Layer w0.28: 32.08,19.85 31.27,19.03 30.23,19.03 29.58,18.38 29.58,18.2 29.5,18.12 29.5,17.77 ; 32.59,10.67 31.63,11.62 30.65,11.62
  vias: v1(19.95,12.02) v1(21.29,19.21) v1(30.27,19.05) v1(32.13,11.14)
VREF_CONN: length 33.6
  Top Layer w0.305: v1(107.78,22.52) 101.68,22.52 101.3,22.14 101.3,8.55 H1.2 H1.1
  Top Layer w0.508: U18.2 v2(86.79,21.31)
  Bottom Layer w0.305: U17.2 110.4,22.52 v1(107.78,22.52)
  Bottom Layer w0.508: v2(86.79,21.31) U19.2
VREF_SEL: length 11.7
  Top Layer w0.178: 37.11,16.11 38.53,17.53 40.91,17.53 ; U16.4 v1(45.68,13.4)
  Bottom Layer w0.178: SW1.7 45.14,13.4 v1(45.68,13.4)
$1N3333: length 9.6
  Top Layer w0.178: 21.06,15.62 v1(22.16,15.62) ; 16.98,12.44 16.98,13.03
  Bottom Layer w0.178: 22.22,15.58 22.31,15.58 22.59,15.3 22.59,13.89 21.85,13.15 17.12,13.15 16.98,13
  vias: v1(16.98,13.03)
$1N3334: length 3.6
  Top Layer w0.178: U2.9 21.16,13.12 18.25,13.12 17.99,12.87 L2.1
$1N3341: length 3.2
  Top Layer w0.178: 20.94,14.61 19.09,14.61 18.62,15.07 18.62,15.75
$1N3343: length 3.1
  Top Layer w0.178: 19.26,8.75 19.33,8.75 19.93,9.34 19.93,10.34 20.23,10.64 21.01,10.64
$1N3498: length 5.1
  Top Layer w0.178: v1(43.77,11.34) 43.77,11.01 44.07,10.72 44.07,10.28 44.23,10.12 R20.2 ; U16.5 v1(42.76,13.4)
  Bottom Layer w0.178: v1(42.76,13.4) 42.88,13.27 42.88,13.12 43.77,12.23 v1(43.77,11.34)
$1N3540: length 1.1
  Top Layer w0.178: 14.23,16.84 14.17,16.9 13.52,16.9 13.34,16.72 13.34,16.61
$1N3543: length 1.3
  Top Layer w0.178: 17.3,16.65 17.06,16.65 16.63,16.22 16.23,16.22
  Top Layer w0.305: 17.35,16.6 R6.1
$1N3571: length 2.3
  Top Layer w0.178: 37.8,11.88 37,11.88 36.31,11.19 36.31,10.67
$1N3574: length 6.5
  Top Layer w0.178: 43.36,10.23 43.36,10.92 v1(43.24,11.04) ; v1(41.87,13.63) 42.12,13.37 42.12,11.98 42.03,11.88 U11.3
  Bottom Layer w0.178: 41.89,13.62 41.89,12.39 v1(43.24,11.04)
$1N4563: length 2.9
  Top Layer w0.178: 36.74,18.42 36.13,19.03 36.13,20.83 36.34,21.04
$1N5175: length 4.8
  Top Layer w0.178: 57.9,1.12 58.15,1.37 58.15,4.54 57.95,4.74 56.98,4.74
$1N6583: length 1.4
  Top Layer w0.178: 56.55,9.73 56.55,8.72 56.8,8.47
$1N7350: length 4.5
  Top Layer w0.178: 34.02,15.56 34.52,15.56 34.58,15.5 34.55,14.98 34.55,14.58 33.47,13.5 33.47,12.01
$1N7411: length 4.2
  Top Layer w0.178: 35.55,12.26 35.49,12.26 34.7,13.05 34.7,13.47 ; 34.7,13.47 34.7,13.56 ; 34.7,13.47 34.69,14.31 34.95,14.57 34.95,15.36 35.13,15.54 35.36,15.54
$1N7511: length 2.9
  Top Layer w0.178: 34.25,22.44 34.39,22.44 34.74,22.09 34.74,20.26 35.01,19.99
$1N7515: length 2
  Top Layer w0.178: 35.6,16.14 35.6,17.78 35.35,18.04
$1N7583: length 1.2
  Top Layer w0.178: 34.25,21.06 34.25,20.54 33.77,20.06
$1N7590: length 3.8
  Top Layer w0.178: 33.62,14.86 33.21,14.86 33.07,15 33.07,17.73 33.36,18.02

## Copper pours and planes (outline as drawn; the poured copper is in the pictures)
3V3 on Top Layer: 25.67,23.54 30.87,23.54 30.87,23.01 25.67,23.01
3V3 on Top Layer: 30.39,24.05 33.62,24.05 33.62,20.85 30.39,20.85
3V3 on Top Layer: 25.83,22.66 31.19,22.66 31.19,18.13 25.83,18.13
3V3 on Top Layer: 60.41,18.07 61.68,18.07 61.68,15.66 60.41,15.66
3V3 on Top Layer: 15.03,11.99 18.34,11.99 18.34,9.98 15.03,9.98
3V3 on Top Layer: 25.67,23.27 26.75,23.27 26.75,21.95 25.67,21.95
3V3 on Inner2: 39.71,7.66 39.7,7.65 39.7,3.96 42.97,0.68 67.84,0.68 67.84,3.98 59.05,3.98 57.65,5.37 47.58,5.37 45.59,7.37 45.59,10.21 43.69,12.1 38.25,12.1 39.71,10.64
3V3 on Inner2: 14.78,12.03 14.78,9.49 17.94,6.32 30.17,6.32 31.46,7.84 31.49,11.32 37.85,18.69 37.85,24.79 26.55,24.79 25.45,23.7 25.45,19.61 25.48,19.59 25.48,17.66 26.34,16.8 28.62,16.8 29.2,17.38 29.2,18.77 29.96,19.52 30.59,19.52 30.61,19.51 30.89,19.51 31.39,20.01 31.39,20.28 31.73,20.62 32.71,20.62 32.79,20.7 33.39,20.1 31.12,16.83 25.51,9.87 20.6,9.87 18.41,12.06 14.81,12.06
3V3 on Inner2: 31.63,11.85 38.26,11.85 39.33,10.79 39.33,10.71 44.15,10.71 44.28,10.83 44.84,10.83 45.43,10.24 45.43,10.27 37.78,17.92 37.78,19.2 31.63,13.05
3V3 on Inner2: 39.2,16.42 59.56,16.42 61.38,18.24 61.76,18.24 62.06,17.95 62.06,15.53 60.92,14.39 41.23,14.39 40.98,14.14 39.2,15.91
3V3 on Inner2: 37.61,24.68 39.57,26.39 41.59,26.39 42.21,25.77 42.21,24.12 37.61,19.52
+5V on Top Layer: 38.34,11.52 37.11,11.52 37.11,10.57 35.84,9.3 35.84,6.6 37.84,6.6 37.87,6.63 37.87,8.1 38.05,8.28 38.75,8.28 39.39,8.92 39.39,10.68 39.35,10.72 38.59,10.72 38.53,10.79 38.53,11.53 38.35,11.53
+5V on Top Layer: 15.99,15.82 16.85,15.82 16.85,14.61 15.99,14.61
+5V on Top Layer: 8.6,9.12 13.83,9.12 13.83,7.81 8.6,7.81
+5V on Inner2: 8.4,9.74 13.11,9.74 17.35,5.51 31.25,5.51 33.13,7.39 33.13,10.82 33.9,11.58 38.4,11.58 38.57,11.42 38.57,10.87 38.79,10.65 39.38,10.65 39.44,10.59 39.44,8.9 38.62,8.09 37.95,8.09 37.83,7.97 37.83,6.28 34.83,3.28 10.62,3.28 8.4,5.5
+5V on Inner2: 8.4,10.41 12.1,14.11 14.08,14.11 15.56,15.59 16.93,15.59 17.09,15.44 17.09,14.15 16.45,13.51 13.81,13.51 13.8,13.53 13.58,13.42 13.54,13.29 13.22,12.08 13.22,9.62 13.32,9.51 12.58,8.77 8.4,8.77 8.4,8.77
GND on Top Layer: 30.92,23.2 32.44,23.2 32.44,20.64 30.92,20.64
GND on Top Layer: 79.66,26.54 94.41,26.54 94.41,-0.05 79.66,-0.05
GND on Top Layer: 99.5,26.67 99.52,26.66 113.67,26.66 113.67,0 99.5,0
GND on Top Layer: 0.11,12.69 18.42,12.69 18.42,0.01 0.11,0.01
GND on Top Layer: 15.73,15.15 15.73,13.83 15.49,13.59 11.74,13.59 11.52,13.8 11.52,15.35 11.52,15.35 11.99,15.35 12.11,15.24 12.11,15.05 12.26,14.89 12.26,14.64 12.5,14.41 13.13,14.41 13.58,14.86 14.14,14.86 14.65,15.37 14.65,15.8 14.83,15.98 15.73,15.98
GND on Top Layer: 41.25,6.37 43.45,6.37 44.53,7.45 44.53,10.9 44.14,11.29 44.46,11.62 45.46,11.62 45.57,11.51 45.57,10.34 45.41,10.18 45.41,10.05 45.81,9.65 46.14,9.65 46.65,9.14 46.65,6.64 45.97,5.95 44.43,5.95 44.01,5.53 41.34,5.53 41.25,5.62
GND on Top Layer: 0.03,26.7 10.45,26.7 10.45,17.07 0.03,17.07
GND on Top Layer: 109.94,22.77 111.34,22.77 111.34,4.23 109.94,4.23
GND on Top Layer: 6.65,17.71 17.3,17.71 17.3,15.96 6.65,15.96
GND on Top Layer: 12.09,14.66 11.59,14.66 11.54,14.61 11.54,14.67 11.3,14.91 8.14,14.91 8.11,14.94 8.11,16.22 8.68,16.79 10.14,16.79 10.24,16.69 10.24,15.73 10.58,15.38 11.92,15.38 12.23,15.08 12.23,14.38 12.23,14.38 12.16,14.3 11.96,14.3 11.96,14.53
GND on Top Layer: 10.37,26.45 56.09,26.45 56.22,26.58 56.22,20.38 56.15,20.31 38.74,20.31 37.98,21.08 35.45,21.08 35.45,21.83 34.95,22.32 34.95,23.72 34.12,24.55 25.87,24.55 25.48,24.17 25.48,22.17 24.85,21.53 24.37,22.01 24.21,22.01 24.21,22.77 23.71,23.28 21.8,23.28 21.17,22.64 21.17,22.37 20.55,21.75 17.25,25.06 10.12,25.06 10.12,26.2
GND on Top Layer: 44.16,1.21 53.27,1.21 53.85,1.79 53.85,4.3 51.95,6.2 45.87,6.2 45.82,6.25 45.82,8.65 46.37,9.19 47.17,9.19 47.35,9.01 47.35,7.52 47.67,7.2 52.43,7.2 52.9,7.67 52.9,10.04 53.87,11.01 55.92,11.01 56.14,10.79 56.14,7.77 56.15,7.75 55.97,7.58 55.2,7.58 54.95,7.33 54.95,6.19 57.69,6.19 58.55,7.05 58.55,9.8 58.58,9.83 58.58,9.98 58.93,10.33 59.74,10.33 59.83,10.24 59.83,1.95 60.34,1.44 64.1,1.44 64.26,1.6 64.26,7.64 68.56,11.94 68.56,17.3 62.38,23.49 62.38,26.3 72.72,26.3 73.27,25.75 73.27,0.16 44.09,0.16 44.05,0.12 44.05,1.1
GND on Top Layer: 20.87,16.97 20.4,16.97 20.17,17.19 20.17,17.72 19.27,18.63 19.27,19.92 19.27,19.92 19.27,19.99 16.37,22.89 14.19,22.89 13.65,22.34 13.65,18.79 13.8,18.64 16.51,18.64 17.66,19.79 17.98,19.79 18.28,19.49 18.28,18.11 19.33,17.06 19.33,16.41 19.82,15.92 20.42,15.92 20.49,15.86 20.49,15.46 20.68,15.26 20.75,15.26 20.93,15.08 21.05,15.08 21.05,14.98 21.04,14.98 20.41,14.98 20.05,15.33 19.73,15.33 19.32,15.74 19.32,15.89 18.9,16.32 18.34,16.32 18.08,16.58 18.08,17.33 17.71,17.71 17.71,18.66 17.48,18.89 17.37,18.89 16.6,18.12 13.49,18.12 13.13,18.49 13.13,22.54 14.02,23.44 16.68,23.44 19.78,20.34 19.78,18.93 20.81,17.9 20.81,17.48 21.03,17.26 21.03,17.13
GND on Top Layer: 42.71,1.45 44.9,1.45 44.9,0.9 42.71,0.9
GND on Top Layer: 25.87,7.93 25.87,6.23 26.63,5.47 41.81,5.47 41.81,7.87 41.38,8.29 40.61,8.29 40.17,8.73 40.17,8.85 40,9.02 40,10.53 39.85,10.69 39.45,10.69 39.45,9.79 39.36,9.7 38.57,9.7 38.74,9.53 39.46,9.53 39.46,8.73 38.83,8.11 38.07,8.11 37.94,7.98 37.83,7.98 37.83,6.71 37.63,6.51 35.82,6.51 35.47,6.87 35.47,8.56 35.82,8.91 36.43,8.91 36.49,8.97 36.49,9.37 36.26,9.6 36.26,9.62 35.91,9.97 35.91,11.18 36.24,11.52 36.24,12.47 37.74,13.97 37.74,15.42 37.5,15.66 36.62,15.66 36.24,15.28 35.27,15.28 35.09,15.1 35.09,13.11 35.84,12.36 35.84,11.77 35.83,11.76 35.16,11.76 35.13,11.73 33.48,11.73 32.94,11.19 31.67,11.05 30.03,11.06 30.05,8.13 29.16,6.78 28.98,6.59 28.4,6.59 27.06,7.93 25.87,7.93
GND on Top Layer: 18.29,8.11 19.96,6.44 19.96,3.61 22.76,0.82 41.76,0.82 42.43,1.49 45.07,1.49 45.15,1.4 45.15,0.14 45.14,0.13 17.96,0.13 17.96,7.78
GND on Top Layer: 17.11,16.02 18,16.02 18,14.83 17.11,14.83
GND on Bottom Layer: 0.08,26.71 74.07,26.71 74.07,0.08 0.08,0.08
GND on Bottom Layer: 79.65,26.56 94.32,26.56 94.32,-0.05 79.65,-0.05
GND on Bottom Layer: 99.5,26.67 113.41,26.67 113.5,26.58 113.5,0.04 113.37,-0.09 99.5,-0.09
GND on Inner1: 0.08,26.71 0.08,0.08 113.8,0.08 113.8,26.71
VCCB on Top Layer: 55.07,10.87 60.98,10.87 60.98,6.23 55.07,6.23
VCCB on Top Layer: 44.99,12.27 45.48,12.27 45.64,12.1 45.64,9.77 45.84,9.57 47.34,9.57 47.83,9.08 47.83,7.84 47.92,7.75 48.5,7.75 48.62,7.87 48.62,10.16 46.2,12.57 45.42,12.57 45.39,12.55 45.03,12.55 44.99,12.51
VCCB on Inner2: 45.78,12.56 58.62,12.54 61.03,10.13 61.03,8.27 58.43,5.66 48.01,5.66 45.67,8.01 45.67,10.22 45.17,10.8 45.15,11.72 45.17,12.54
INT_VERF on Top Layer: 42.07,13.25 42.12,13.3 44.17,13.3 44.17,12.4 44.17,12.4 43.47,12.4 43.47,12.16 43.21,11.9 42.99,11.57 42.86,11.06 42.86,9.54 42.76,9.44 42.25,9.44 42.07,9.61
INT_VERF on Top Layer: 40.75,11.57 40.75,10.86 40.69,10.8 40.03,10.8 40.02,10.8 39.99,10.78 39.99,8.97 40.72,8.24 41.84,8.24 42.36,7.72 42.36,7.67 43.11,6.92 43.11,6.82 43.3,6.63 43.88,6.63 43.94,6.7 43.94,9.59 43.87,9.67 42.94,9.67 42.49,10.12 42.49,11.62 40.8,11.62
JTAG_VREF on Bottom Layer: 66.63,21.76 69.93,21.76 69.93,20.74 66.63,20.74
JTAG_VREF on Inner2: 62.31,15.15 62.31,20.87 63.2,21.76 69.41,21.76 69.41,20.85 69.3,20.74 66.89,20.74 66.5,20.36 64.47,20.36 64.47,12.74 61.55,12.74 61.55,14.39
JTAG_VREF on Inner2: 62.69,12.87 62.19,14.9 60.81,13.9 45.48,13.9 45.12,13.54 45.13,13.55 45.13,12.83 45.29,12.68
USB_5V on Top Layer: 11.89,16.03 14.52,16.03 14.52,14.56 11.89,14.56
USB_5V on Inner2: 6.73,17.09 14.78,17.09 14.86,17 14.86,15.22 14.38,14.74 13.63,14.74 13.2,14.31 12.12,14.31 8.44,10.64 6.73,10.64 6.73,10.64
VCORE on Inner2: 19.3,12.21 14.7,12.21 14.7,9.23 17.77,6.15 30.17,6.15 31.7,7.68 31.7,11.36 32.09,11.76 32.63,11.76 32.78,11.61 32.78,7.23 31.08,5.53 17.34,5.53 13.31,9.56 13.68,13.4 18.48,13.61 19.3,12.8
VCORE on Inner2: 33.09,20.14 32.67,20.56 31.8,20.56 31.43,20.19 31.43,19.99 30.91,19.47 30.05,19.47 29.28,18.7 29.23,18.7 29.23,17.32 28.6,16.69 26.26,16.69 25.37,17.57 25.37,23.71 24.25,24.84 20.48,24.84 18.84,23.2 18.84,21.67 20.17,20.33 20.17,19.11 21.43,17.85 21.43,14.99 22.16,14.26 22.16,13.43 21.6,12.87 18.91,12.87 18.55,12.51 18.55,12.19 20.77,9.97 25.37,9.97 32.03,18.49
$1N3546 on Top Layer: 8.62,11.17 13.23,11.17 13.23,9.99 8.62,9.99

Small or netless copper shapes (teardrops, artwork), in the pictures only: 255 on Top Layer, 51 on Bottom Layer

## Text on the board
Bottom Silkscreen Layer: JLCJLCJLCJLC | 2V5 | 1V8 | 3V3 | 1 | 0 | VREF | TMS | TCK | TDO | TDI | NC | OFF | ON | BOARG / VERF | JTAG / VERF
Top Silkscreen Layer: 3V3 | 2V5 | 1V8 | TOP | BOTTOM | RXD | TXD | GND | 1 | 0 | RF/IMPCAS | {
